# EAGLE design RPI-Lora-Gateway (EAGLE 7.6.0)
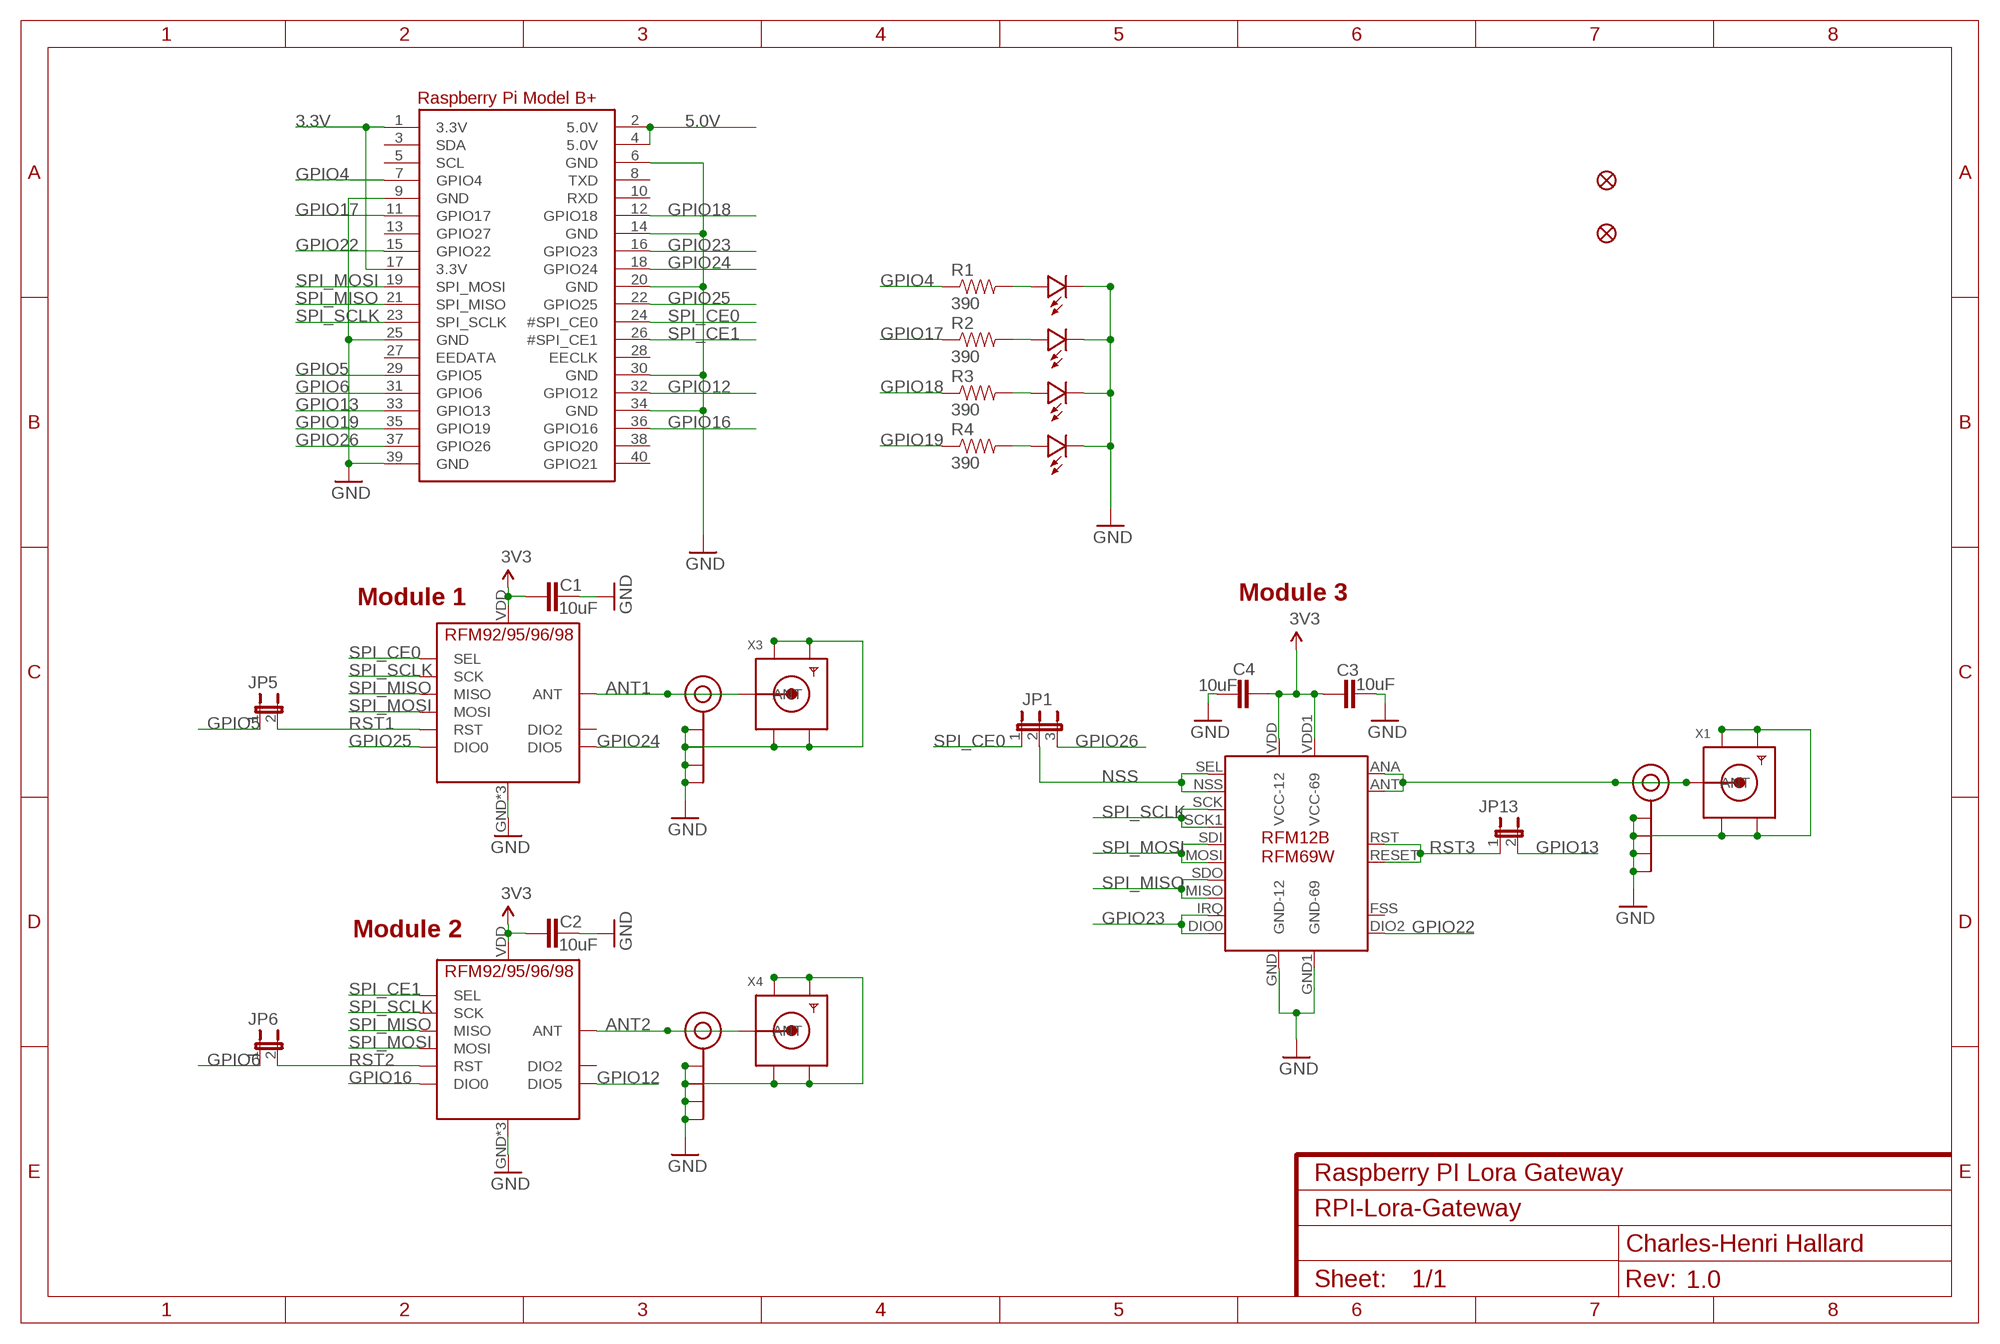
[diagram p0: schematic, sheet 1]
NAME (FRAME-A4L): CNAME: Raspberry PI Lora Gateway; CREVISION: 1.0; DESIGNER: Charles-Henri Hallard

## Parts
C1  10uF  CAP0805-CAP  [0805-CAP]
C2  10uF  CAP0805-CAP  [0805-CAP]
C3  10uF  CAP0805-CAP  [0805-CAP]
C4  10uF  CAP0805-CAP  [0805-CAP]
FID2  FIDUCIAL""  [FIDUCIAL_1MM]
FID3  FIDUCIAL""  [FIDUCIAL_1MM]
J$1  ANTENNATINY  [SMA_UFL_PAD_TINY]
J$2  ANTENNATINY  [SMA_UFL_PAD_TINY]
J$3  ANTENNATINY  [SMA_UFL_PAD_TINY]
JP1  JUMPER3  [JUMPER3]
JP5  JUMPER2  [JUMPER2]
JP6  JUMPER2  [JUMPER2]
JP13  JUMPER2  [JUMPER2]
R1  390  RESISTOR0805-RES  [0805-RES]
R2  390  RESISTOR0805-RES  [0805-RES]
R3  390  RESISTOR0805-RES  [0805-RES]
R4  390  RESISTOR0805-RES  [0805-RES]
RPI1  RASPBERRYPI_BPLUS_HATNOSLOTS  [PI_HAT_NOSLOTS]
U$1  RFM95  [RFM95]
U$2  RFM95  [RFM95]
U$3  RFM-DUAL  [RFM-DUAL]
U$4  IO4  LED0805  [0805-LED]
U$5  IO17  LED0805  [0805-LED]
U$6  IO18  LED0805  [0805-LED]
U$7  IO19  LED0805  [0805-LED]
X1  SMACONNECTOR  [SMA90_DIP]
X3  SMACONNECTOR  [SMA90_DIP]
X4  SMACONNECTOR  [SMA90_DIP]

## Nets
3.3V: C1.1 C2.1 C3.1 C4.1 RPI1.1(3.3V) RPI1.17(3.3V) U$1.VDD(VCC) U$2.VDD(VCC) U$3.VDD1(VCC-69) U$3.VDD(VCC-12) ; supply symbol labelled 3V3
5.0V: RPI1.2(5.0V) RPI1.4(5.0V)
ANT1: J$1.ANT1(SIGNAL) J$1.ANT2(SIGNAL) J$1.ANT3(SIGNAL) U$1.ANT X3.ANTENNA(ANT)
ANT2: J$2.ANT1(SIGNAL) J$2.ANT2(SIGNAL) J$2.ANT3(SIGNAL) U$2.ANT X4.ANTENNA(ANT)
GND: C1.2 C2.2 C3.2 C4.2 J$1.GND1(GND) J$1.GND2(GND) J$1.GND3(GND) J$1.GND4(GND) J$2.GND1(GND) J$2.GND2(GND) J$2.GND3(GND) J$2.GND4(GND) J$3.GND1(GND) J$3.GND2(GND) J$3.GND3(GND) J$3.GND4(GND) RPI1.6(GND) RPI1.9(GND) RPI1.14(GND) RPI1.20(GND) RPI1.25(GND) RPI1.30(GND) RPI1.34(GND) RPI1.39(GND) U$1.GND U$1.GND1(GND) U$1.GND2(GND) U$2.GND U$2.GND1(GND) U$2.GND2(GND) U$3.GND1(GND-69) U$3.GND(GND-12) U$4.MINUS U$5.MINUS U$6.MINUS U$7.MINUS X1.GND1 X1.GND2 X1.GND3 X1.GND4 X3.GND1 X3.GND2 X3.GND3 X3.GND4 X4.GND1 X4.GND2 X4.GND3 X4.GND4
GPIO4: R1.1 RPI1.7(GPIO4)
GPIO5: JP5.1 RPI1.29(GPIO5)
GPIO6: JP6.1 RPI1.31(GPIO6)
GPIO12: RPI1.32(GPIO12) U$2.DIO5
GPIO13: JP13.2 RPI1.33(GPIO13)
GPIO16: RPI1.36(GPIO16) U$2.DIO0
GPIO17: R2.1 RPI1.11(GPIO17)
GPIO18: R3.1 RPI1.12(GPIO18)
GPIO19: R4.1 RPI1.35(GPIO19)
GPIO22: RPI1.15(GPIO22) U$3.DIO2
GPIO23: RPI1.16(GPIO23) U$3.DIO0 U$3.IRQ
GPIO24: RPI1.18(GPIO24) U$1.DIO5
GPIO25: RPI1.22(GPIO25) U$1.DIO0
GPIO26: JP1.3 RPI1.37(GPIO26)
N$14: J$3.ANT1(SIGNAL) J$3.ANT2(SIGNAL) J$3.ANT3(SIGNAL) U$3.ANA(ANT-12) U$3.ANT(ANT-69) X1.ANTENNA(ANT)
N$16: R4.2 U$7.PLUS
N$18: R1.2 U$4.PLUS
N$26: R2.2 U$5.PLUS
N$27: R3.2 U$6.PLUS
NSS: JP1.2 U$3.NSS(SEL-12) U$3.SEL(SEL-69)
RST1: JP5.2 U$1.RST
RST2: JP6.2 U$2.RST
RST3: JP13.1 U$3.RESET U$3.RST
SPI_CE0: JP1.1 RPI1.24(#SPI_CE0) U$1.NSS(SEL)
SPI_CE1: RPI1.26(#SPI_CE1) U$2.NSS(SEL)
SPI_MISO: RPI1.21(SPI_MISO) U$1.MISO U$2.MISO U$3.MISO U$3.SDO
SPI_MOSI: RPI1.19(SPI_MOSI) U$1.MOSI U$2.MOSI U$3.MOSI U$3.SDI
SPI_SCLK: RPI1.23(SPI_SCLK) U$1.SCK U$2.SCK U$3.SCK U$3.SCK1
Unconnected: RPI1.3(SDA) RPI1.5(SCL) RPI1.8(TXD) RPI1.10(RXD) RPI1.13(GPIO27) RPI1.27(EEDATA) RPI1.28(EECLK) RPI1.38(GPIO20) RPI1.40(GPIO21) U$1.DIO2 U$2.DIO2 U$3.FSS(FFS)

## Notes on the sheet
- Module 1 | Module 3
- Module 2

## Library data of the parts
C1-C4 = _c2h:CAP: Capacitor Standard 0603 ceramic capacitor, and 0.1" leaded capacitor.
FID2 FID3 = microbuilder:FIDUCIAL: Fiducial Alignment Points Various fiducial points for machine vision alignment.; BOM: EXCLUDE
J$1-J$3 = _c2h:ANTENNA: SMA Antenna Connector End launch SMA connector. The paste layer has been removed so that the connector can be hand soldered onto the board after reflow.
JP1 = microbuilder:JUMPER3: JUMPER - 3 Pins
JP5 JP6 JP13 = microbuilder:JUMPER2: JUMPER - 2 Pins
R1-R4 = _c2h:RESISTOR: Resistor Basic schematic elements and footprints for 0603, 1206, and PTH resistors.
RPI1 = microbuilder:RASPBERRYPI_BPLUS
U$1 U$2 = _c2h:RFM95
U$3 = _c2h:RFM-DUAL
U$4-U$7 = _c2h:LED
X1 X3 X4 = _c2h:SMACONNECTOR: SMA Connector 90° DIP SMA Connector, 50 Ohm (4UConnector: 07259)

## Board
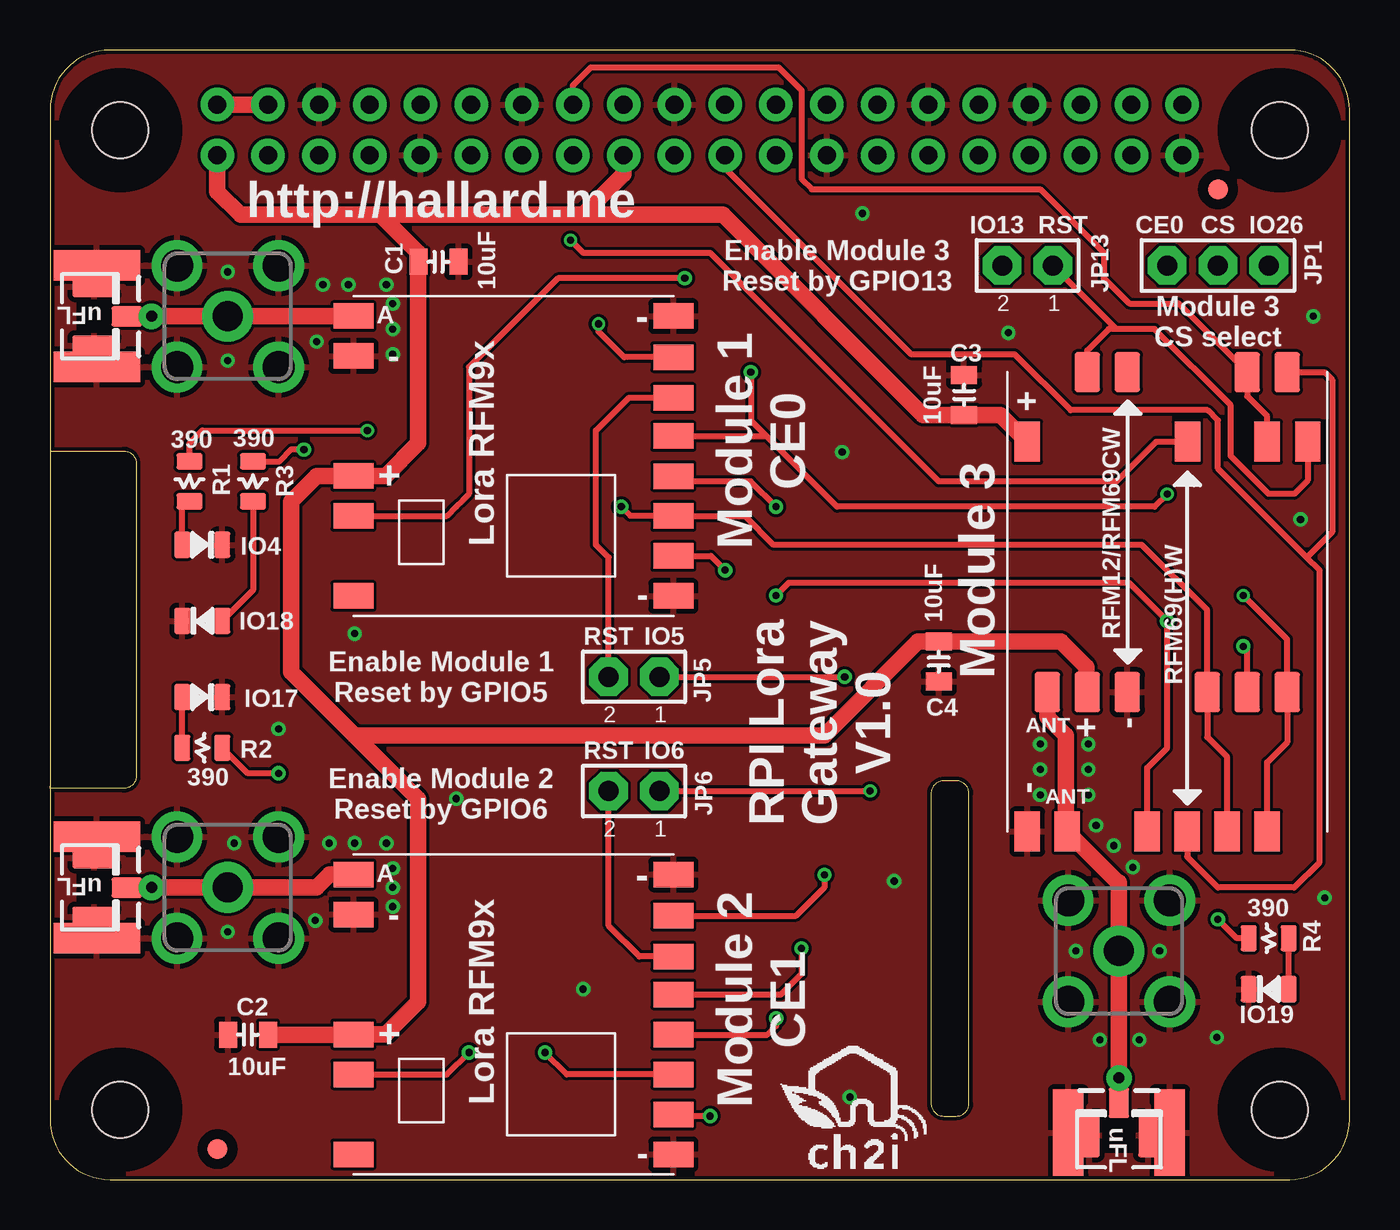
[diagram p1: board, top side]
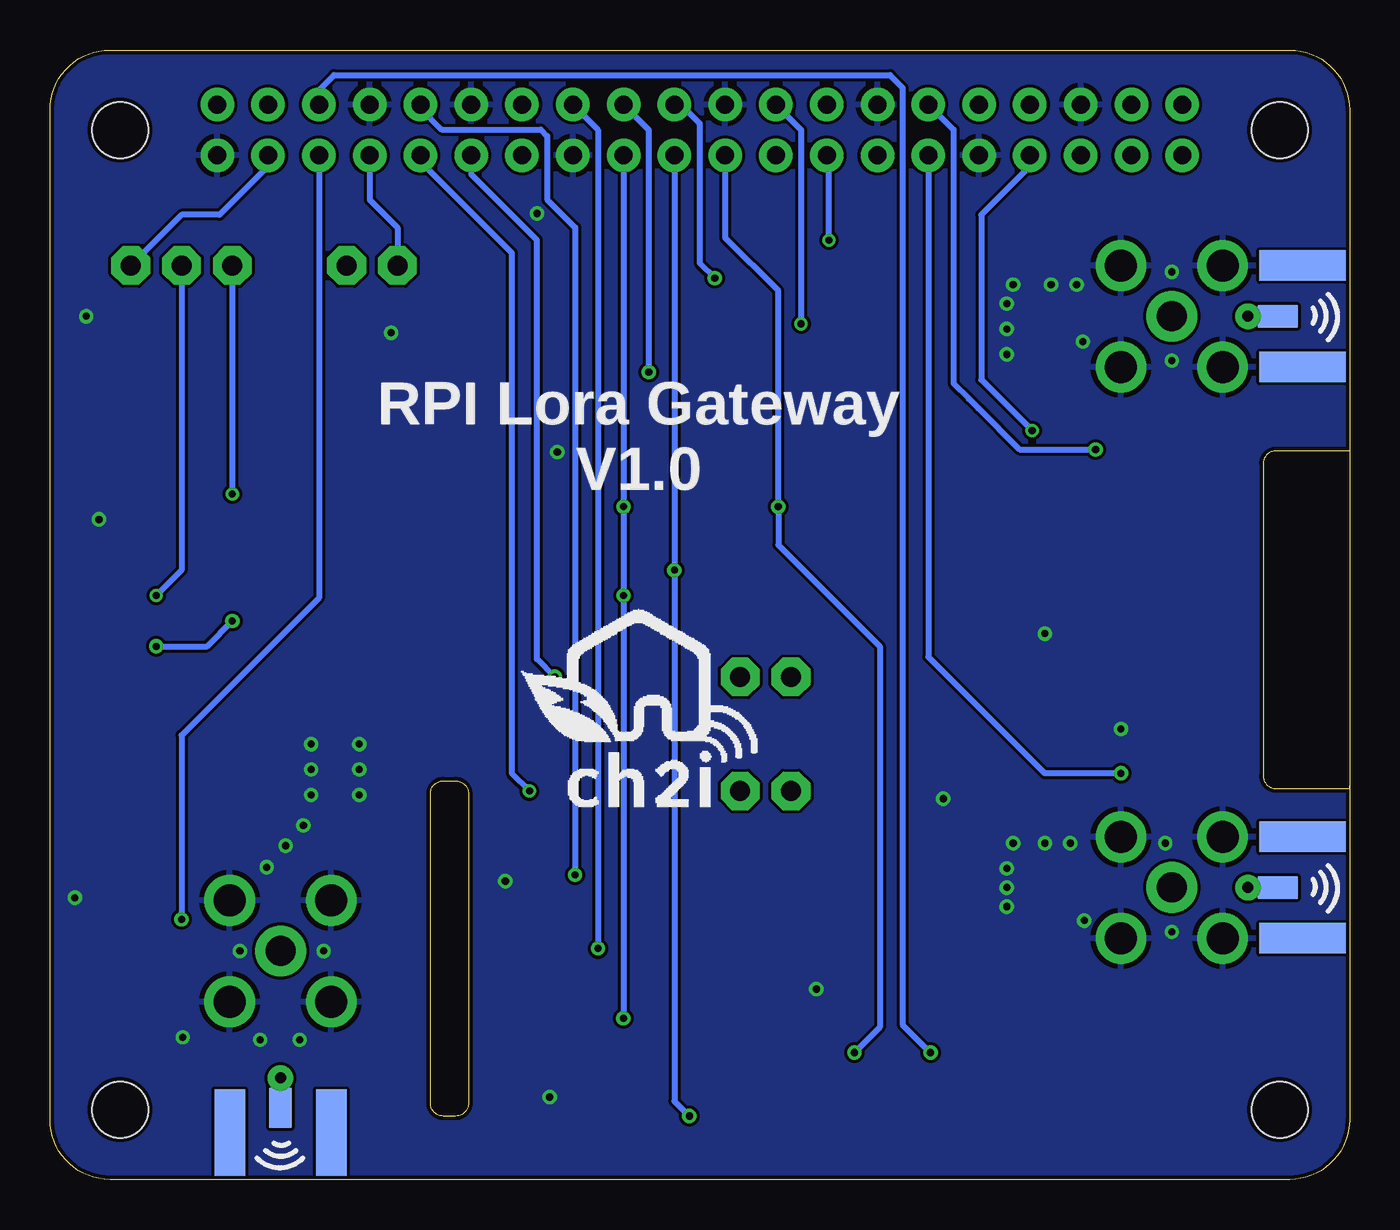
[diagram p2: board, bottom side, seen from below]

Size 65 x 56.5 mm. Coordinates in mm from the lower left corner, seen from the top.
Outline: 0,36.45 3.68,36.45 arc-90 4.32,35.81 4.32,20.19 arc-90 3.68,19.56 0,19.56 0,19.68
Outline: 44.7,3.17 45.34,3.17 arc90 45.97,3.81 45.97,19.3 arc90 45.34,19.94 44.7,19.94 arc90 44.07,19.3 44.07,3.81 arc90 44.7,3.17
Copper layers (1*16): Top 0.035mm / dielectric 1.5mm / Bottom 0.035mm
Design rules "ElectroDragon_2layer_DRU_no_angle_20140221": minimum track width 6mil, minimum drill 12mil, track to track 6mil, track to pad 6mil, pad to pad 6mil, via to via 6mil, smd to smd 6mil, copper to edge 8mil, drill to drill 6mil, minimum pad ring 10mil, minimum via ring 6mil, stop-mask expansion 4mil, vias tented up to drill 100mil, thermal gap 10mil

### Footprints (pad centres in the part's own frame; a part is rotated, then mirrored left to right if it is on the bottom)
0805-CAP = smd 0.902 x 1.3: 1 -1,0; 2 1,0
FIDUCIAL_1MM = smd 1 x 1: 1 0,0
SMA_UFL_PAD_TINY = smd 1.524 x 1.016: ANT1 -3.843,0 | drill 0.559 pad 1.27: ANT2 -5.08,0 | smd 2.032 x 1.143 bottom: ANT3 -3.589,0 | smd 2.2 x 1.016: GND1 -2.223,1.47; GND2 -2.223,-1.47 | smd 4.318 x 1.524: GND3 -2.349,-2.54; GND4 -2.349,2.54 | smd 4.318 x 1.524 bottom: GND5 -2.349,2.54; GND6 -2.349,-2.54
JUMPER3 = drill 1 pad 1.93 octagon: 1 -2.54,0; 2 0,0; 3 2.54,0
JUMPER2 = drill 1 pad 1.93 octagon: 1 2.54,0; 2 0,0
0805-RES = smd 0.8 x 1.3: 1 -1,0; 2 1,0
PI_HAT_NOSLOTS = drill 0.9 pad 1.676: 1 8.37,51.23; 2 8.37,53.77; 3 10.91,51.23; 4 10.91,53.77; 5 13.45,51.23; 6 13.45,53.77; 7 15.99,51.23; 8 15.99,53.77; 9 18.53,51.23; 10 18.53,53.77; 11 21.07,51.23; 12 21.07,53.77; 13 23.61,51.23; 14 23.61,53.77; 15 26.15,51.23; 16 26.15,53.77; 17 28.69,51.23; 18 28.69,53.77; 19 31.23,51.23; 20 31.23,53.77; 21 33.77,51.23; 22 33.77,53.77; 23 36.31,51.23; 24 36.31,53.77; 25 38.85,51.23; 26 38.85,53.77; 27 41.39,51.23; 28 41.39,53.77; 29 43.93,51.23; 30 43.93,53.77; 31 46.47,51.23; 32 46.47,53.77; 33 49.01,51.23; 34 49.01,53.77; 35 51.55,51.23; 36 51.55,53.77; 37 54.09,51.23; 38 54.09,53.77; 39 56.63,51.23; 40 56.63,53.77 | hole 2.8: 3.5,3.5; 3.5,52.5; 61.5,52.5; 61.5,3.5
RFM95 = smd 2 x 1.27: ANT 5.777,-7; DIO0 5.777,3; DIO2 5.779,7; DIO5 -10.225,-4.936; GND 5.777,-5; GND1 -10.223,7; GND2 -10.23,-7; MISO -10.23,5; MOSI -10.225,3; NSS -10.223,-1; RST -10.223,-2.905; SCK -10.23,1.012; VDD 5.777,1
RFM-DUAL = smd 2 x 1.27: ANA -10.54,5; ANT -3.555,6; DIO0 8.96,-5; DIO2 8.96,-1.012; FSS 12.447,2; GND -3.555,2; GND1 -10.54,7; IRQ 12.445,-4; MISO -10.54,-1; MOSI -10.54,-3; NSS -10.54,-5; RESET 12.447,4; RST 8.96,-7.032; SCK -3.555,-4; SCK1 -10.54,1; SDI -3.555,-2; SDO 12.445,-6; SEL -3.555,-6; VDD -3.555,4; VDD1 8.96,7
0805-LED = smd 0.8 x 1.3: MINUS -1,0; PLUS 1,0
SMA90_DIP = drill 1.5 pad 2.54: ANTENNA 0,0 | drill 1.6 pad 2.54: GND1 -2.54,2.54; GND2 2.54,2.54; GND3 -2.54,-2.54; GND4 2.54,-2.54

### Placement (x,y rotation side)
C1  19.43,45.91 0 top
C2  9.91,7.24 180 top
C3  45.72,39.24 90 top
C4  44.45,25.91 270 top
FID2  8.38,1.52 0 top
FID3  58.42,49.53 0 top
J$1  0,43.18 180 top
J$2  0,14.61 180 top
J$3  53.47,0 270 top
JP1  58.42,45.72 0 top
JP5  27.94,25.15 0 top
JP6  27.94,19.43 0 top
JP13  47.62,45.72 0 top
R1  6.99,34.92 270 top
R2  7.62,21.59 180 top
R3  10.16,34.92 270 top
R4  60.96,12.06 0 top
RPI1  0,0 0 top
U$1  20.95,36.2 180 top
U$2  20.95,8.26 180 top
U$3  55.88,27.94 90 top
U$4  7.62,31.75 180 top
U$5  7.62,24.13 180 top
U$6  7.62,27.94 0 top
U$7  60.96,9.53 0 top
U$8  [LOGO_CH2I_75MM]  40.64,2.54 0 top
U$9  [LOGO_CH2I_110MM]  34.92,21.59 0 bottom
X1  53.47,11.43 0 top
X3  8.89,43.18 0 top
X4  8.89,14.61 0 top

### Tracks (layer width: path | path; a pad name or v marks a point on that pad's centre or on a via)
3.3V
  Top 0.305: 18.41,46.35 18.41,45.93 C1.1
  Top 0.813: RPI1.1 8.37,49.41 9.53,48.26 16.51,48.26 | 16.51,48.26 18.41,46.35 18.41,36.83 16.78,35.2 U$1.VDD 15.16,35.18 13.34,35.18 12.06,33.91 12.06,25.4 15.24,22.23 | C2.1 15.16,7.24 U$2.VDD 16.78,7.25 18.41,8.89 18.41,19.05 15.24,22.23 | RPI1.17 28.69,50.28 26.67,48.26 | 26.67,48.26 16.51,48.26 | 26.67,48.26 33.66,48.26 43.67,38.24 C3.1 47.54,38.24 U$3.VDD1 | 51.88,24.84 U$3.VDD 51.83,24.34 51.83,25.64 50.56,26.91 C4.1 43.42,26.91 38.73,22.23 15.24,22.23
5.0V
  Top 0.813: RPI1.4 RPI1.2
ANT1
  Top 0.406: J$1.ANT1 J$1.ANT2
  Top 0.813: U$1.ANT 8.9,43.2 | 8.9,43.2 X3.ANTENNA | 8.9,43.2 5.09,43.2 J$1.ANT2
  Bottom 0.406: J$1.ANT3 J$1.ANT2
ANT2
  Top 0.406: J$2.ANT1 J$2.ANT2
  Top 0.813: U$2.ANT 13.98,15.26 13.34,14.61 X4.ANTENNA J$2.ANT2
  Bottom 0.406: J$2.ANT3 J$2.ANT2
GND  (via drill 0.36 pad 0.71)
  other vias: 15.24,27.3 54.48,6.99 52.51,6.99 63.75,14.1 58.36,7.11 49.53,19.24 9.21,16.83 8.89,12.38 13.97,16.83 15.24,16.83 16.83,16.83 17.14,15.56 17.14,14.61 17.14,13.65 8.89,40.96 8.89,45.4 13.65,44.77 14.92,44.77 16.83,44.77 17.14,43.81 17.14,42.55 17.14,41.27 13.34,41.91 13.27,12.95 47.94,42.35 63.18,43.18 40.01,4.13 42.23,14.92 26.67,9.53 20.32,19.05 11.43,22.54 54.17,15.62 53.21,16.7 52.32,17.72 55.5,11.43 51.31,11.43 51.94,19.24 51.94,20.51 51.94,21.78 49.53,20.51 49.53,21.78 39.62,36.39 40.64,48.32 62.55,33.02
  pour Top: -1.27,57.15 66.04,57.15 66.04,-1.27 -1.27,-1.27
  pour Bottom: -2.54,58.42 67.31,58.42 67.31,-2.54 -2.54,-2.54
GPIO4  (via drill 0.36 pad 0.61)
  Top 0.305: R1.1 6.99,36.83 7.62,37.47 v15.88,37.47
  Bottom 0.305: v15.88,37.47 18.41,40.01 18.41,48.26 15.99,50.69 RPI1.7
GPIO5  (via drill 0.36 pad 0.71)
  Top 0.305: JP5.1 v39.75,25.15
  Bottom 0.305: RPI1.29 43.93,50.28 40.64,46.99 40.64,26.04 v39.75,25.15
GPIO6  (via drill 0.36 pad 0.61)
  Top 0.305: JP6.1 v41.02,19.43
  Bottom 0.305: RPI1.31 46.47,50.91 41.91,46.35 41.91,20.32 v41.02,19.43
GPIO12  (via drill 0.36 pad 0.71)
  Top 0.305: v38.73,15.24 38.73,14.61 37.32,13.19 U$2.DIO5
  Bottom 0.305: v38.73,15.24 38.73,47.62 40.13,49.02 40.13,52.2 40.45,52.51 45.4,52.51 46.47,53.58 RPI1.32
GPIO13
  Bottom 0.305: RPI1.33 49.01,49.01 47.62,47.62 JP13.2
GPIO16  (via drill 0.36 pad 0.71)
  Top 0.305: U$2.DIO0 19.86,5.25 v20.95,6.35
  Bottom 0.305: RPI1.36 51.55,54.49 50.8,55.24 22.99,55.24 22.35,54.61 22.35,7.75 v20.95,6.35
GPIO17  (via drill 0.36 pad 0.71)
  Top 0.305: v11.43,20.32 9.89,20.32 R2.1
  Bottom 0.305: v11.43,20.32 15.24,20.32 21.07,26.15 RPI1.11
GPIO18  (via drill 0.36 pad 0.71)
  Top 0.305: v12.7,36.51 12.06,36.51 11.48,35.92 10.53,35.92
  Top 0.406: R3.1 10.53,35.92
  Bottom 0.305: RPI1.12 19.81,52.51 19.81,39.81 19.05,39.05 18.57,38.58 16.51,36.51 v12.7,36.51
GPIO19  (via drill 0.36 pad 0.71)
  Top 0.305: R4.1 59.37,12.06 v58.42,13.02
  Bottom 0.305: RPI1.35 51.55,29.09 58.42,22.23 v58.42,13.02
GPIO22  (via drill 0.36 pad 0.61)
  Top 0.305: U$3.DIO2 55.31,36.9 53.34,34.92 44.45,34.92 33.02,46.35 26.67,46.35 v26.04,46.99
  Bottom 0.305: v26.04,46.99 26.04,51.12 RPI1.15
GPIO23
  Top 0.305: U$3.DIO0 60.88,38.18 59.88,39.18 U$3.IRQ 56.45,43.81 53.98,43.81 52.7,45.09 52.7,46.35 49.53,49.53 38.1,49.53 37.59,50.04 37.59,54.48 36.45,55.63 27.05,55.63 26.15,54.73 RPI1.16
GPIO24  (via drill 0.36 pad 0.61)
  Top 0.305: 31.16,41.15 U$1.DIO5 28.72,41.13 27.43,42.42 v27.43,42.8
  Bottom 0.305: RPI1.18 27.43,52.51 v27.43,42.8
GPIO25  (via drill 0.36 pad 0.71)
  Top 0.305: v31.75,45.09 25.4,45.09 20.95,40.64 20.95,34.29 20.64,33.97 20.32,33.66 19.86,33.2 U$1.DIO0
  Bottom 0.305: RPI1.22 33.45,53.77 32.51,52.83 32.51,45.85 v31.75,45.09
GPIO26
  Bottom 0.305: RPI1.37 54.09,50.69 56.52,48.26 58.42,48.26 JP1.3
N$14
  Top 0.305: J$3.ANT1 J$3.ANT2
  Top 0.813: U$3.ANA 50.8,17.48 50.8,22.23 49.88,23.14 U$3.ANT | 50.8,17.32 U$3.ANA | J$3.ANT2 X1.ANTENNA 53.47,14.86 53.42,14.86 U$3.ANA
  Bottom 0.305: J$3.ANT3 J$3.ANT2
N$16
  Top 0.305: U$7.PLUS R4.2
N$18
  Top 0.305: U$4.PLUS 6.62,33.56 R1.2
N$26
  Top 0.305: R2.2 U$5.PLUS
N$27
  Top 0.305: R3.2 10.16,29.48 U$6.PLUS
NSS  (via drill 0.36 pad 0.61)
  Top 0.305: U$3.NSS 60.88,20.88 61.88,21.88 U$3.SEL 61.88,27.02 v59.69,29.21
  Bottom 0.305: JP1.2 58.42,30.48 v59.69,29.21
RST1
  Top 0.305: JP5.2 27.94,31.11 27.3,31.75 27.3,37.47 28.94,39.1 U$1.RST
RST2
  Top 0.305: U$2.RST 29.48,11.16 27.94,12.7 JP6.2
RST3
  Top 0.305: U$3.RST 62.91,34.97 62.23,34.29 60.96,34.29 59.05,36.2 59.05,38.73 55.24,42.55 53.34,42.55 | U$3.RESET 51.88,41.47 52.96,42.55 53.34,42.55 | 53.34,42.55 JP13.1
SPI_CE0  (via drill 0.36 pad 0.61, 0.36 pad 0.71)
  Top 0.305: v55.88,34.29 55.24,33.66 39.37,33.66 35.83,37.2 | U$1.NSS 35.83,37.2 | v35.05,40.39 35.05,37.97 35.83,37.2
  Bottom 0.305: v35.05,40.39 35.05,52.51 RPI1.24 | JP1.1 v55.88,34.29
SPI_CE1  (via drill 0.36 pad 0.71)
  Top 0.305: U$2.NSS 36.56,9.26 37.59,10.29 v37.59,11.56
  Bottom 0.305: v37.59,11.56 37.59,52.51 RPI1.26
SPI_MISO  (via drill 0.36 pad 0.71)
  Top 0.305: U$3.MISO 56.88,16.14 58.42,14.61 62.23,14.61 63.5,15.88 63.5,30.48 62.87,31.11 | 62.87,31.11 58.42,35.56 58.42,37.97 57.91,38.48 51.05,38.48 48.26,41.27 43.09,41.27 33.77,50.59 RPI1.21 | U$3.SDO 63.76,40.38 64.14,40.01 64.14,32.38 62.87,31.11 | U$1.MISO 33.05,31.2 v33.77,30.48 | U$2.MISO 30.48,3.25 30.56,3.17 v33.02,3.17 31.27,3.17 U$2.MISO
  Bottom 0.305: RPI1.21 v33.77,30.48 33.77,3.92 v33.02,3.17
SPI_MOSI  (via drill 0.36 pad 0.71)
  Top 0.305: U$3.MOSI 58.88,21.13 57.88,22.13 U$3.SDI 57.88,28.48 54.61,31.75 36.2,31.75 34.75,33.2 U$1.MOSI 29.04,33.2 v28.57,33.66 | U$2.MOSI 25.86,5.25 v24.77,6.35
  Bottom 0.305: RPI1.19 31.23,47.1 28.57,44.45 v28.57,33.66 28.57,31.75 23.5,26.67 23.5,7.62 v24.77,6.35
SPI_SCLK  (via drill 0.36 pad 0.71)
  Top 0.305: U$1.SCK 31.44,34.92 35.04,34.92 v36.31,33.66 | U$2.SCK 35.88,7.24 36.32,7.68 v36.32,8.06 | U$3.SCK1 54.88,20.59 55.88,21.59 v55.88,27.94 53.98,29.84 36.95,29.84 v36.31,29.21 | U$3.SCK 59.88,26.48 v59.69,26.67
  Bottom 0.305: RPI1.23 v36.31,33.66 v36.31,29.21 36.31,8.78 v36.32,8.06 | v59.69,26.67 57.15,26.67 v55.88,27.94

### Text on the board
tPlace: http://hallard.me | IO13 | RST | CE0 | CS | IO26 | Enable Module 3 / Reset by GPIO13 | Module 3 / CS select | Lora RFM9x | Module 1 / CE0 | Module 3 | RST | IO5 | Enable Module 1 / Reset by GPIO5 | RPI Lora / Gateway / V1.0 | RST | IO6 | Enable Module 2 / Reset by GPIO6 | Lora RFM9x | Module 2 / CE1
bPlace: RPI Lora Gateway / V1.0